# Altium schematic sheet 下层功率板.SchDoc
size A4; SheetNumber: 2; SheetTotal: 3
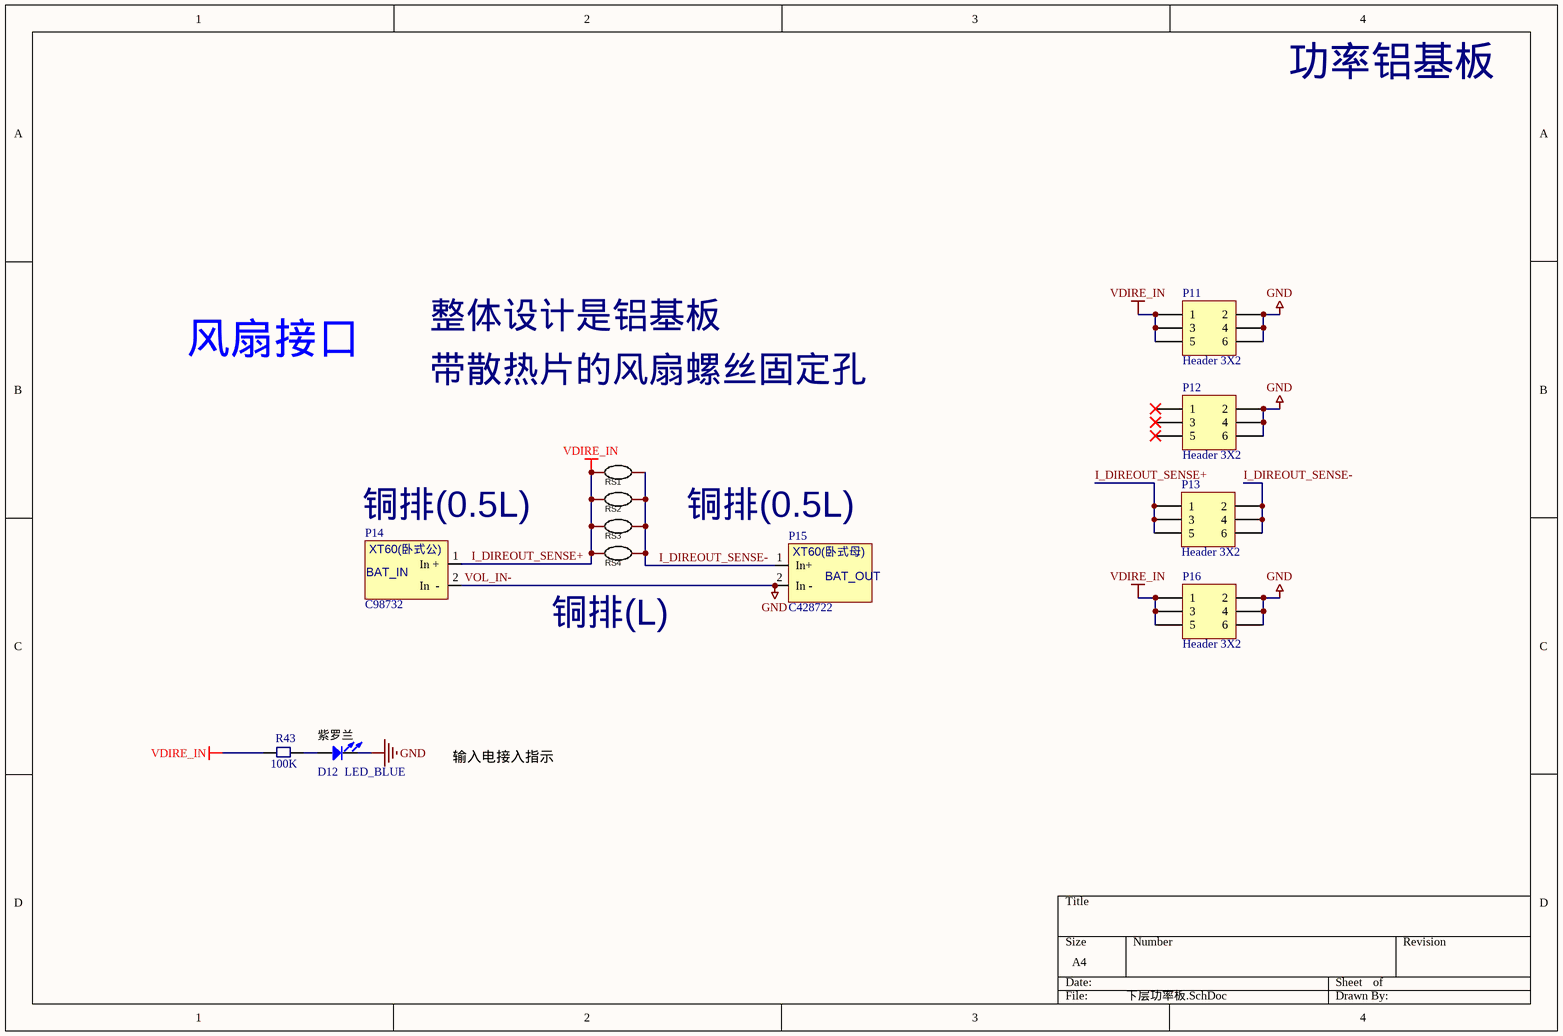
[diagram p0: 下层功率板.SchDoc]

## Parts
D12  LED_BLUE  [LED-0603W]
P11  Header 3X2  [HDR-SMD_6P-P2.54-V-M-R2-C3-LS7.5-2]
P12  Header 3X2  [HDR-SMD_6P-P2.54-V-M-R2-C3-LS7.5-2]
P13  Header 3X2  [HDR-SMD_6P-P2.54-V-M-R2-C3-LS7.5-2]
P14  C98732  [XT60 PT M]
P15  C428722  [XT60 PT F]
P16  Header 3X2  [HDR-SMD_6P-P2.54-V-M-R2-C3-LS7.5-2]
R43  100K  [R0805]
RS1  HolRS3920-5W-0.3mR-1%  [R3920]  (value not drawn)
RS2  HolRS3920-5W-0.3mR-1%  [R3920]  (value not drawn)
RS3  HolRS3920-5W-0.3mR-1%  [R3920]  (value not drawn)
RS4  HolRS3920-5W-0.3mR-1%  [R3920]  (value not drawn)

## Nets
I_DIREOUT_SENSE+: P11.1 P11.3 P11.5 P13.1 P13.3 P13.5 P14.1(In_+) P16.1 P16.3 P16.5 R43.2 RS1.1 RS2.1 RS3.1 RS4.1  [also labelled VDIRE_IN]
VOL_IN-: D12.2(K) P11.2 P11.4 P11.6 P12.2 P12.4 P12.6 P14.2(In__-) P15.2(In_-) P16.2 P16.4 P16.6  [also labelled GND]
I_DIREOUT_SENSE-: P13.2 P13.4 P13.6 P15.1(In+) RS1.2 RS2.2 RS3.2 RS4.2
NetD12_1: D12.1(A) R43.1

Not connected (* = marked no-connect by the designer): P12 1* 3* 5*

## Notes on the sheet
- 功率铝基板
- 风扇接口
- 整体设计是铝基板
- 带散热片的风扇螺丝固定孔
- (near P14) 铜排(0.5L)
- 铜排(0.5L)
- (near RS4) 铜排(L)
- (near D12) 紫罗兰
- 输入电接入指示
- (in symbol P_PW_XT60_FM_卧式) XT60(卧式母); BAT_OUT
- (in symbol P_PW_XT60_M_卧式) XT60(卧式公); BAT_IN

## Library data of the parts
D12 = LED: Typical INFRARED GaAs LED; Published: 8-Jun-2000; LatestRevisionDate: 08-Jul-2005; LatestRevisionNote: Mech Layer 1 removed.; PackageReference: LED-0; Publisher: Altium Limited; PackageDescription: LED; 2 Leads
P11-P13 P16 = Header 3X2: Header, 3-Pin, Dual row / PZ127-2-03-S / C3975186; LatestRevisionDate: 17-Jul-2002; LatestRevisionNote: Re-released for DXP Platform.; Publisher: Altium Limited
P14 = P_PW_XT60_M_卧式: XT60_PW_M / XT60公头输入
P15 = P_PW_XT60_FM_卧式: XT60_PW_M / XT60母头输入
R43 = Res: Resistor; Published: 8-Jun-2000; LatestRevisionDate: 17-Jul-2002; LatestRevisionNote: Re-released for DXP Platform.; PackageReference: AXIAL-0.4; Publisher: Altium Limited
RS1-RS4 = C558626: Manufacturer: Milliohm(毫欧); Name: 0.3mΩ; Add into BOM: yes; Value: 0.3mΩ; Tolerance: ±1%; Power(Watts): 5W; Symbol: HOLRS3920-5W-0.3MR-1%; Device: HolRS3920-5W-0.3mR-1%; LCSC Part Name: 0.3mΩ ±1% 5W; Supplier Part: C558626; Manufacturer Part: HolRS3920-5W-0.3mR-1%; Supplier Footprint: 3920; JLCPCB Part Class: Extended Part; Datasheet: https://atta.szlcsc.com/upload/public/pdf/source/20200522/C558625_7915B34B9186274EB7EA9862EBA9CEA8.pdf; Supplier: LCSC; Convert to PCB: yes